# EAGLE design Front LEDs v1b (EAGLE 9.4.2)
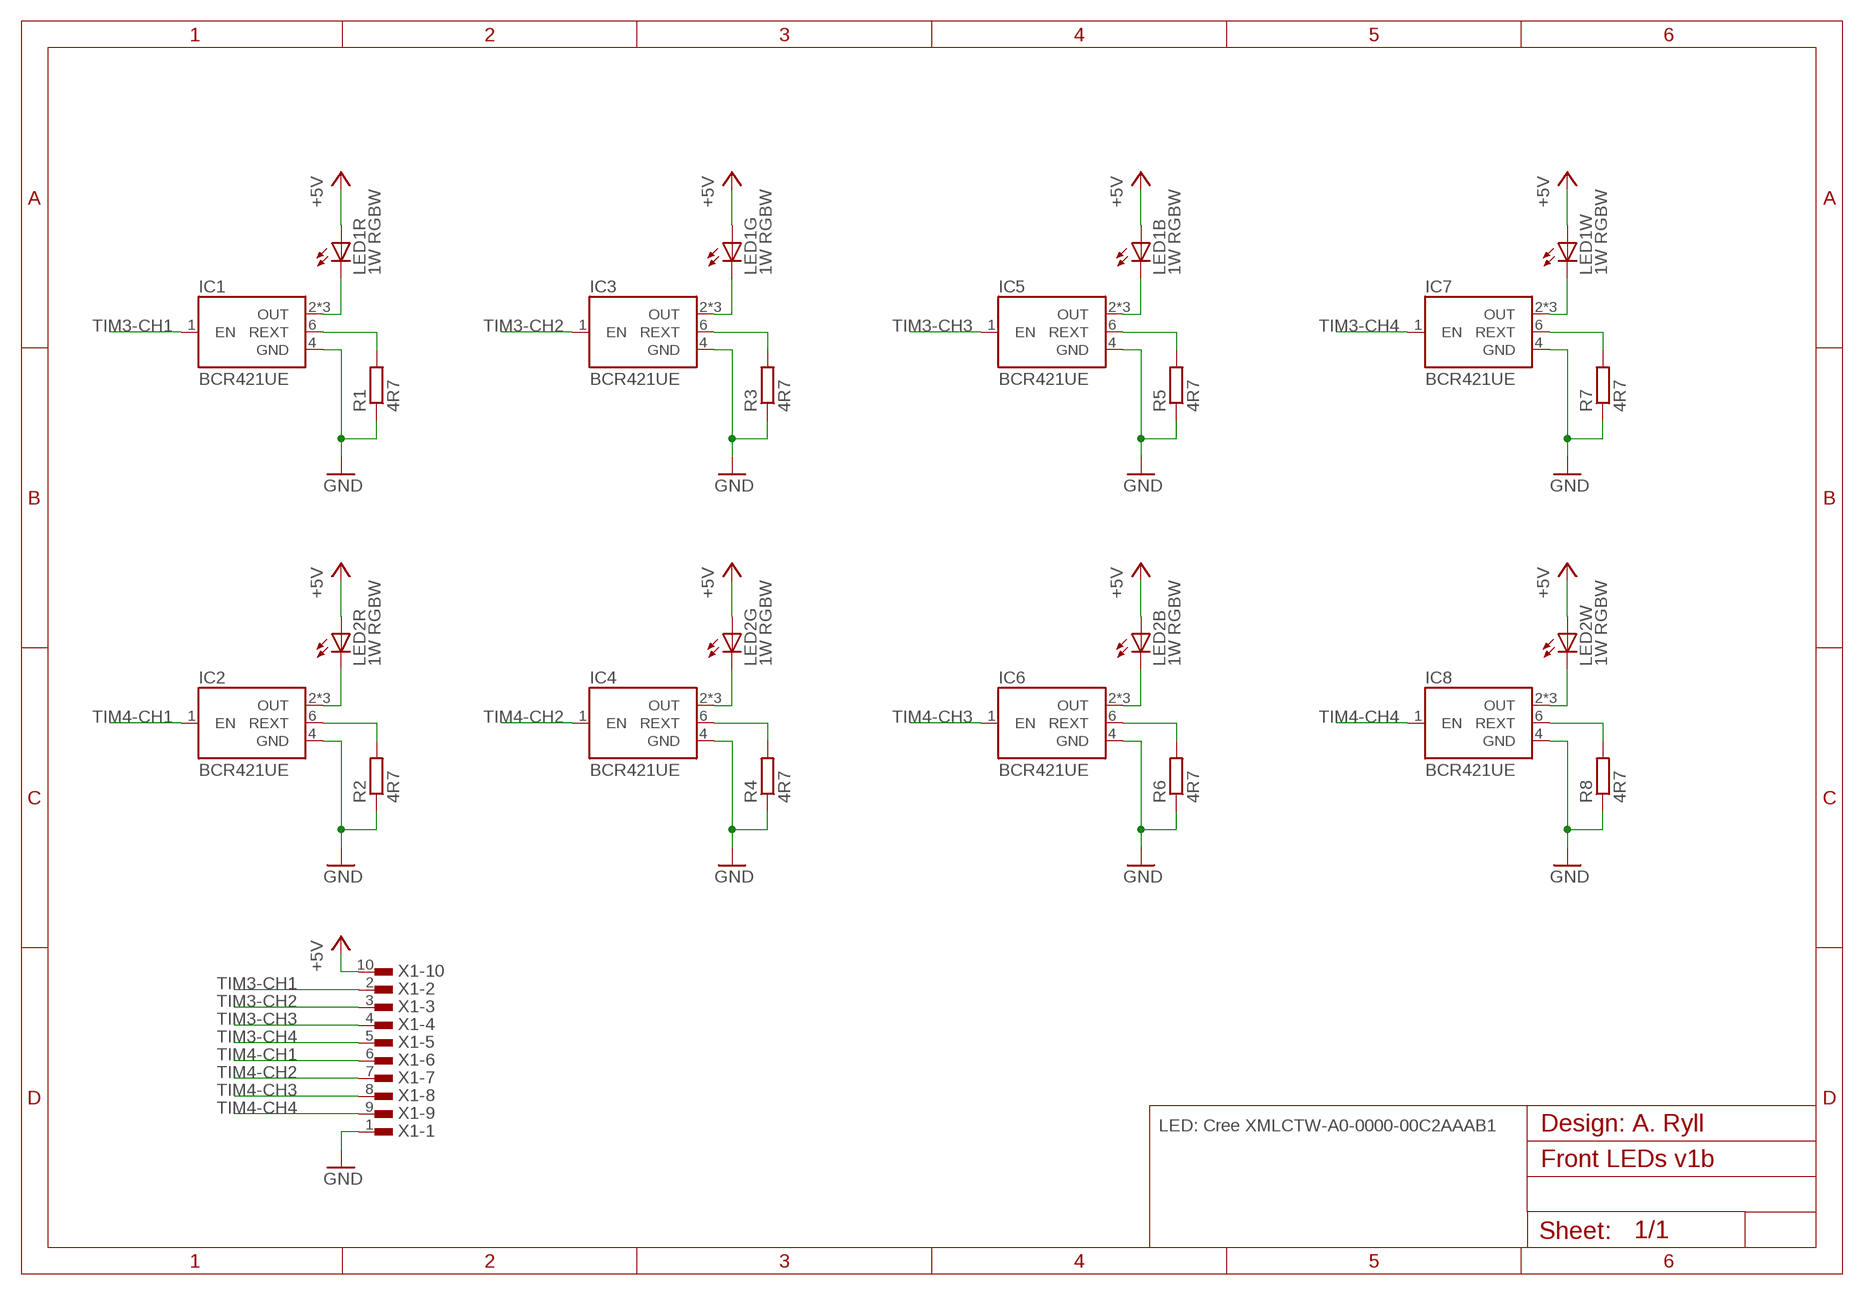
[diagram p0: schematic, sheet 1]

## Parts
IC1  BCR421UE  BCR420_1  [SOT26]
IC2  BCR421UE  BCR420_1  [SOT26]
IC3  BCR421UE  BCR420_1  [SOT26]
IC4  BCR421UE  BCR420_1  [SOT26]
IC5  BCR421UE  BCR420_1  [SOT26]
IC6  BCR421UE  BCR420_1  [SOT26]
IC7  BCR421UE  BCR420_1  [SOT26]
IC8  BCR421UE  BCR420_1  [SOT26]
LED1  1W RGBW  CREE-XLAMP  [CREE-XLAMP]
LED2  1W RGBW  CREE-XLAMP  [CREE-XLAMP]
R1  4R7  R-EU_R0805  [R0805]
R2  4R7  R-EU_R0805  [R0805]
R3  4R7  R-EU_R0805  [R0805]
R4  4R7  R-EU_R0805  [R0805]
R5  4R7  R-EU_R0805  [R0805]
R6  4R7  R-EU_R0805  [R0805]
R7  4R7  R-EU_R0805  [R0805]
R8  4R7  R-EU_R0805  [R0805]
X1  TE-FPC-1MM-10H  [TE-1-84952-0]

## Nets
+5V: LED1.1(R:A) LED1.2(G:A) LED1.3(B:A) LED1.4(W:A) LED2.1(R:A) LED2.2(G:A) LED2.3(B:A) LED2.4(W:A) X1.10
GND: IC1.4(GND) IC2.4(GND) IC3.4(GND) IC4.4(GND) IC5.4(GND) IC6.4(GND) IC7.4(GND) IC8.4(GND) R1.1 R2.1 R3.1 R4.1 R5.1 R6.1 R7.1 R8.1 X1.1
N$219: IC1.2(OUT) IC1.3(OUT) IC1.5(OUT) LED1.8(R:C)
N$220: IC1.6(REXT) R1.2
N$221: IC3.2(OUT) IC3.3(OUT) IC3.5(OUT) LED1.7(G:C)
N$222: IC3.6(REXT) R3.2
N$223: IC5.2(OUT) IC5.3(OUT) IC5.5(OUT) LED1.6(B:C)
N$224: IC5.6(REXT) R5.2
N$225: IC7.2(OUT) IC7.3(OUT) IC7.5(OUT) LED1.5(W:C)
N$226: IC7.6(REXT) R7.2
N$227: IC2.2(OUT) IC2.3(OUT) IC2.5(OUT) LED2.8(R:C)
N$228: IC2.6(REXT) R2.2
N$229: IC4.2(OUT) IC4.3(OUT) IC4.5(OUT) LED2.7(G:C)
N$230: IC4.6(REXT) R4.2
N$231: IC6.2(OUT) IC6.3(OUT) IC6.5(OUT) LED2.6(B:C)
N$232: IC6.6(REXT) R6.2
N$233: IC8.2(OUT) IC8.3(OUT) IC8.5(OUT) LED2.5(W:C)
N$234: IC8.6(REXT) R8.2
TIM3-CH1: IC1.1(EN) X1.2
TIM3-CH2: IC3.1(EN) X1.3
TIM3-CH3: IC5.1(EN) X1.4
TIM3-CH4: IC7.1(EN) X1.5
TIM4-CH1: IC2.1(EN) X1.6
TIM4-CH2: IC4.1(EN) X1.7
TIM4-CH3: IC6.1(EN) X1.8
TIM4-CH4: IC8.1(EN) X1.9

## Notes on the sheet
- LED: Cree XMLCTW-A0-0000-00C2AAAB1 | Design: A. Ryll

## Library data of the parts
IC1-IC8 = TIGERs:BCR420_1
LED1 LED2 = TIGERs:CREE-XLAMP; PARTNR: XMLCTW-A0-0000-00C2AAAB1
R1-R8 = rcl:R-EU_: RESISTOR, European symbol; SPICEPREFIX: R
X1 = TIGERs:TE-FPC-1MM-10: TE Connectivity 1.0 FPC, ZIF V/T, SMT, 10P Part Number: 1-1734248-0

## Board
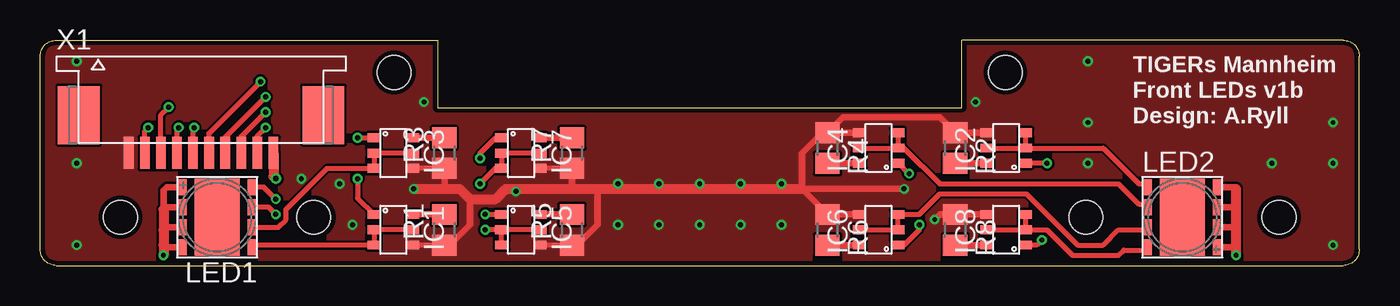
[diagram p1: board, top side]
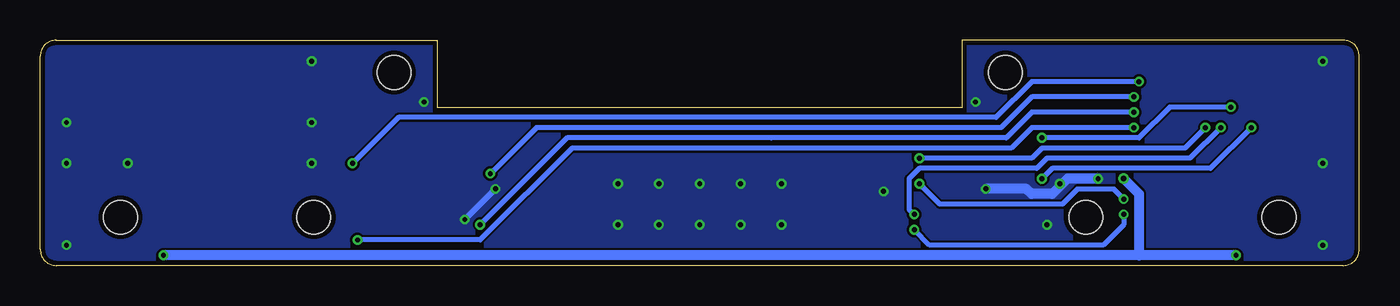
[diagram p2: board, bottom side, seen from below]

Size 82 x 14 mm. Coordinates in mm from the lower left corner, seen from the top.
Outline: 1,0 81,0 arc90 82,1 82,13 arc90 81,14 57.3,14 57.3,9.8 24.7,9.8 24.7,14 1,14 arc90 0,13 0,1 arc90 1,0
Copper layers (1*16): Top 0.035mm / dielectric 1.5mm / Bottom 0.035mm
Design rules "PCB-POOL Standard *": minimum track width 0.15mm, minimum drill 0.3mm, track to track 0.15mm, track to pad 0.15mm, pad to pad 0.15mm, via to via 0.15mm, smd to smd 0.15mm, copper to edge 0.3mm, drill to drill 0.2mm, minimum pad ring 0.2mm, minimum via ring 0.15mm, stop-mask expansion 0.075mm, vias tented up to drill 14mil, thermal gap 0.2mm
Holes 2.1 mm at 5,3 17,3 77,3 65,3 22,12 60,12
bKeepout: area 3,1 to 7,5; area 15,1 to 19,5; area 63,1 to 67,5; area 75,1 to 79,5; area 20,10 to 24,14; area 58,10 to 62,14

### Footprints (pad centres in the part's own frame; a part is rotated, then mirrored left to right if it is on the bottom)
SOT26 = smd 0.55 x 0.8: 1 -0.95,-1.2; 2 0,-1.2; 3 0.95,-1.2; 4 0.95,1.2; 5 0,1.2; 6 -0.95,1.2
CREE-XLAMP = smd 0.5 x 1: 1 2.14,1.875; 2 2.14,0.625; 3 2.14,-0.625; 4 2.14,-1.875; 5 -2.14,-1.875; 6 -2.14,-0.625; 7 -2.14,0.625; 8 -2.14,1.875 | smd 2.78 x 4.78: PAD 0,0
R0805 = smd 1.3 x 1.5: 1 -0.95,0; 2 0.95,0
TE-1-84952-0 = smd 0.6 x 2: 1 -4.5,-6; 2 -3.5,-6; 3 -2.5,-6; 4 -1.5,-6; 5 -0.5,-6; 6 0.5,-6; 7 1.5,-6; 8 2.5,-6; 9 3.5,-6; 10 4.5,-6 | smd 2.6 x 3.6: G1 -7.6,-3.65; G2 7.6,-3.65

### Placement (x,y rotation side)
IC1  21.95,2.22 270 top
IC2  60.05,7.3 90 top
IC3  21.95,6.99 270 top
IC4  52.11,7.3 90 top
IC5  29.89,2.22 270 top
IC6  52.11,2.22 90 top
IC7  29.89,6.99 270 top
IC8  60.05,2.22 90 top
LED1  11,3 180 top
LED2  71,3 0 top
R1  25.12,2.22 90 top
R2  56.88,7.3 270 top
R3  25.12,6.99 90 top
R4  48.94,7.3 270 top
R5  33.06,2.22 90 top
R6  48.94,2.22 270 top
R7  33.06,6.99 90 top
R8  56.88,2.22 270 top
X1  10,13 0 top

### Tracks (layer width: path | path; a pad name or v marks a point on that pad's centre or on a via)
+5V  (via drill 0.3, 0.35)
  Top 0.406: LED1.4 7.87,4.88 7.66,4.67 7.66,3.49 7.8,3.62 LED1.3 | LED1.2 7.81,2.38 7.66,2.22 | LED1.1 7.81,1.12 7.66,1.27 | LED2.4 74.19,1.12 74.34,1.27 | LED2.3 74.19,2.38 74.34,2.22 | LED2.2 74.2,3.62 74.34,3.49 | LED2.1 74.22,4.88 74.34,4.76
  Top 0.61: 7.66,3.49 7.66,2.22 7.66,1.27 v7.66,0.64 | 74.34,4.76 74.34,3.49 74.34,2.22 74.34,1.27 v74.34,0.64 | X1.10 14.5,5.54 v14.65,5.4
  Bottom 0.61: v7.66,0.64 13.7,0.64 | 13.7,0.64 v74.34,0.64 | 13.7,0.64 13.7,4.45 v14.65,5.4
GND  (via drill 0.3)
  Top 0.305: R3.1 IC3.4 | R1.1 IC1.4 | R7.1 IC7.4 | R5.1 IC5.4
  Top 0.406: IC2.4 R2.1 55.92,9.21 49.89,9.21 49.1,8.41 | IC8.4 R8.1 55.92,3.17 v55.61,2.86 | 49.1,8.41 R4.1 48.62,8.25 47.35,6.99 47.35,4.76 | 47.35,4.76 R6.1 IC6.4 | v53.7,4.76 47.35,4.76 | IC4.4 49.26,8.25 49.1,8.41 | R7.1 33.06,4.76 | R5.1 33.38,1.27 34.65,2.54 34.65,4.76 | R3.1 25.12,4.76 | R1.1 25.45,1.27 26.71,2.54 26.71,4.13
  Top 0.61: v23.22,4.76 25.12,4.76 26.08,4.76 26.71,4.13 28.3,4.13 28.94,4.76 33.06,4.76 34.65,4.76 47.35,4.76
  Bottom 0.406: v55.61,2.86 v53.7,4.76
  Bottom 0.61: v16.23,5.4 18.14,5.4 19.09,4.45 20.36,4.45 20.68,4.76 v23.22,4.76
  other vias: 2.27,6.35 2.27,1.27 80.37,1.27 2.27,12.7 41,2.54 38.46,2.54 35.92,2.54 35.92,5.08 38.46,5.08 41,5.08 43.54,5.08 43.54,2.54 46.08,2.54 46.08,5.08 23.86,10.16 58.14,10.16 65.13,12.7 65.13,8.89 80.37,8.89 76.56,6.35 80.37,6.35 65.13,6.35 19.41,2.54 29.57,4.6 18.62,5.08
  pour Top (no thermals): -0.91,14.92 83.23,14.92 83.23,-1.27 -0.91,-1.27
  pour Bottom (no thermals): -1.86,15.88 84.18,15.88 84.18,-2.22 -1.86,-2.22
N$219
  Top 0.305: LED1.8 13.29,1.27 IC1.3 IC1.2 IC1.5
N$220
  Top 0.406: IC1.6 R1.2
N$221
  Top 0.305: IC3.3 20.68,6.04 | 20.68,6.04 17.82,6.04 15.28,3.49 15.28,2.86 14.8,2.38 LED1.7 | 20.68,6.04 20.75,6.11 IC3.2 IC3.5
N$222
  Top 0.406: IC3.6 R3.2
N$223  (via drill 0.3)
  Top 0.305: IC5.2 28.62,2.22 | 28.62,2.22 v27.66,2.22 | v14.65,3.17 14.2,3.62 LED1.6 | IC5.3 28.69,2.15 | 28.69,2.15 28.62,2.22 | IC5.5 28.76,2.22 28.69,2.15
  Bottom 0.305: v14.65,3.17 14.65,2.54 15.92,1.27 26.71,1.27 v27.66,2.22
N$224
  Top 0.406: IC5.6 R5.2
N$225  (via drill 0.3)
  Top 0.305: v14.65,4.13 13.9,4.88 LED1.5 | IC7.3 28.62,6.04 | 28.62,6.04 28.3,6.04 v27.35,5.08 | 28.62,6.04 28.69,6.11 IC7.2 IC7.5
  Bottom 0.305: v27.35,5.08 27.03,4.76 26.08,3.81 18.46,3.81 17.5,4.76 15.28,4.76 v14.65,4.13
N$226
  Top 0.406: IC7.6 R7.2
N$227
  Top 0.305: IC2.2 66.08,7.3 68.31,5.08 68.66,5.08 LED2.8 | IC2.5 IC2.2 | IC2.3 IC2.2
N$228
  Top 0.406: IC2.6 R2.2
N$229
  Top 0.305: IC4.2 53.7,7.3 55.92,5.08 67.03,5.08 68.31,3.81 68.67,3.81 LED2.7 | IC4.3 IC4.2 | IC4.5 IC4.2
N$230
  Top 0.406: IC4.6 R4.2
N$231
  Top 0.305: LED2.6 68.71,2.22 67.03,2.22 66.08,1.27 64.5,1.27 61.32,4.45 55.92,4.45 54.65,3.17 IC6.3 IC6.2 IC6.5
N$232
  Top 0.406: IC6.6 R6.2
N$233
  Top 0.305: IC8.2 62.59,2.22 64.18,0.64 67.03,0.64 67.35,0.95 68.69,0.95 LED2.5 | IC8.5 IC8.2 | IC8.3 IC8.2
N$234
  Top 0.406: IC8.6 57.51,1.27 R8.2
TIM3-CH1  (via drill 0.3)
  Top 0.305: X1.2 6.5,8.36 v6.71,8.57 | IC1.1 19.73,4.2 v19.73,5.4
  Bottom 0.305: v6.71,8.57 9.25,6.03 19.09,6.03 v19.73,5.4
TIM3-CH2  (via drill 0.3)
  Top 0.305: X1.3 7.5,9.36 v7.98,9.84 | v19.73,7.94 IC3.1
  Bottom 0.305: v7.98,9.84 11.79,9.84 13.7,7.94 v19.73,7.94
TIM3-CH3  (via drill 0.3)
  Top 0.305: X1.4 8.5,8.46 v8.62,8.57 | v27.66,3.17 v27.67,3.17 IC5.1
  Bottom 0.305: v8.62,8.57 10.52,6.67 19.41,6.67 20.05,6.03 27.35,6.03 27.98,5.4 27.98,3.49 v27.66,3.17
TIM3-CH4  (via drill 0.3)
  Top 0.305: X1.5 9.5,8.51 v9.57,8.57 | v27.35,6.67 27.35,6.99 28.3,7.93 IC7.1
  Bottom 0.305: v9.57,8.57 10.84,7.3 19.73,7.3 20.36,6.67 v27.35,6.67
TIM4-CH1  (via drill 0.3)
  Top 0.305: X1.6 10.5,8.23 v13.7,11.43 | v62.59,6.35 IC2.1
  Bottom 0.305: v13.7,11.43 20.36,11.43 22.59,9.21 59.73,9.21 v62.59,6.35
TIM4-CH2  (via drill 0.3)
  Top 0.305: X1.7 11.5,7.96 v14.01,10.48 | v54.02,5.71 53.38,6.35 IC4.1
  Bottom 0.305: v14.01,10.48 20.36,10.48 22.27,8.57 51.16,8.57 v54.02,5.71
TIM4-CH3  (via drill 0.3)
  Top 0.305: X1.8 12.5,8.01 v14.01,9.53 | v54.65,2.54 54.65,2.22 53.7,1.27 IC6.1
  Bottom 0.305: v14.01,9.53 20.36,9.53 21.95,7.94 36.55,7.94 49.26,7.94 v54.65,2.54
TIM4-CH4  (via drill 0.3)
  Top 0.305: X1.9 13.5,8.06 v14.01,8.57 | v62.27,1.59 61.96,1.27 IC8.1
  Bottom 0.305: v14.01,8.57 20.36,8.57 21.63,7.3 48.94,7.3 54.65,1.59 v62.27,1.59

### Text on the board
tPlace: TIGERs Mannheim | Front LEDs v1b | Design: A.Ryll